# EAGLE schematic VoltageSourcePCB (EAGLE 9.4.2)
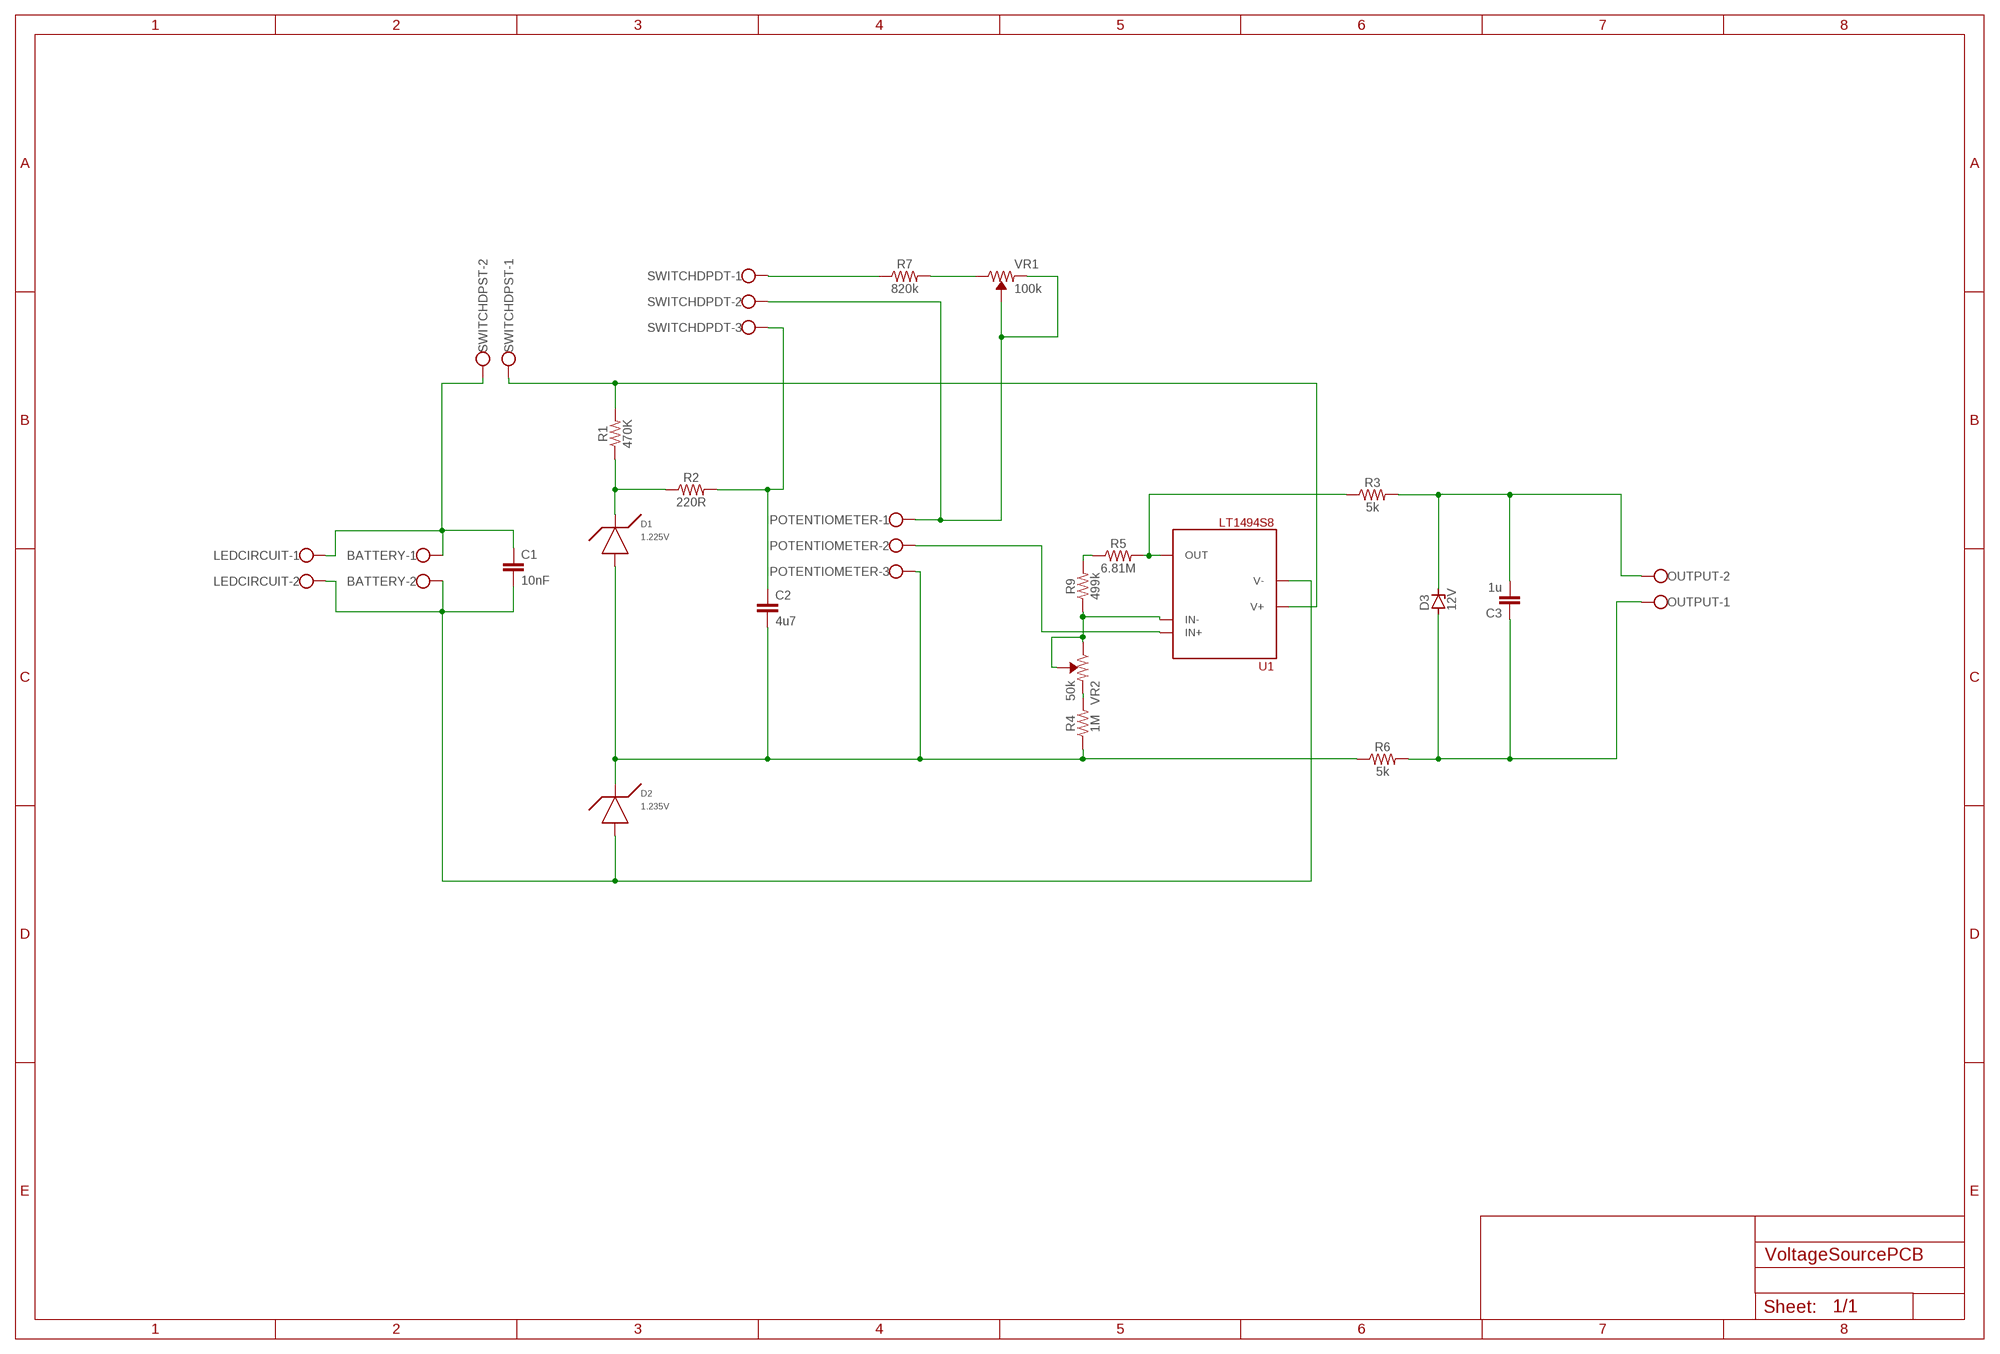
[diagram p0: schematic, sheet 1]

## Parts
BATTERY  W237-102  [W237-102]
C1  10nF  C5/2.5  [C5B2.5]
C2  4u7  C22/11  [C22.5B11]
C3  1u  C-EU150-072X183  [C150-072X183]
D1  1.225V  LT1004CZ1.225V  [LT1004CZ]
D2  1.235V  LT1004CZ1.235V  [LT1004CZ]
D3  12V  ZENER-DIODEC1702-15  [C1702-15]
LEDCIRCUIT  W237-102  [W237-102]
OUTPUT  W237-102  [W237-102]
POTENTIOMETER  W237-103  [W237-103]
R1  470K  RESISTOR0805  [0805]
R2  220R  RESISTOR0805  [0805]
R3  5k  RESISTOR0805  [0805]
R4  1M  RESISTOR0805  [0805]
R5  6.81M  RESISTOR0805  [0805]
R6  5k  RESISTOR0805  [0805]
R7  820k  RESISTOR0805  [0805]
R9  499k  RESISTOR0805  [0805]
SWITCHDPDT  W237-103  [W237-103]
SWITCHDPST  W237-102  [W237-102]
U1  LT1494S8  [LT1494]
VR1  100k  TRIMPOT-SMD-3MM-OPEN-1/10W-25%  [TRIMPOT-SMD-TC33X]
VR2  50k  TRIMPOT-SMD-3MM-OPEN-1/10W-25%  [TRIMPOT-SMD-TC33X]

## Nets
N$1: BATTERY.1 C1.1
N$2: BATTERY.2 C1.2
N$3: D2.ANODE LEDCIRCUIT.2 U1.4(V-)
N$4: LEDCIRCUIT.1 SWITCHDPST.2
N$5: R1.2 SWITCHDPST.1 U1.7(V+)
N$6: D1.CATHODE R1.1 R2.1
N$7: C2.2 D1.ANODE D2.CATHODE POTENTIOMETER.3 R4.1 R6.1
N$8: C2.1 R2.2 SWITCHDPDT.3
N$9: POTENTIOMETER.2 U1.3(IN+)
N$10: R3.1 R5.2 U1.6(OUT)
N$11: POTENTIOMETER.1 SWITCHDPDT.2 VR1.2(WIPER) VR1.3(CCW)
N$12: R7.1 SWITCHDPDT.1
N$13: R9.1 U1.2(IN-) VR2.1(CW) VR2.2(WIPER)
N$16: C3.2 D3.C OUTPUT.2 R3.2
N$17: C3.1 D3.A OUTPUT.1 R6.2
N$18: R4.2 VR2.3(CCW)
N$19: R7.2 VR1.1(CW)
N$20: R5.1 R9.2

## Library data of the parts
BATTERY LEDCIRCUIT OUTPUT SWITCHDPST = con-wago-500:W237-102: WAGO SCREW CLAMP; MPN: 237-102; OC_FARNELL: unknown; OC_NEWARK: 70K9898
C1 C2 = capacitor-wima:C: CAPACITOR naming: grid - package width
C3 = rcl:C-EU: CAPACITOR, European symbol; SPICEPREFIX: C
D1 D2 = RequiredComponents:LT1004CZ: Description: This is a LT1004CZ zener diode that is contained in a 3 pin holder. This can be used as a micropower voltage reference
D3 = diode:ZENER-DIODE: Z-Diode
POTENTIOMETER SWITCHDPDT = con-wago-500:W237-103: WAGO SCREW CLAMP; MPN: 237-103; OC_FARNELL: unknown; OC_NEWARK: 18M7116
R1-R7 R9 = SparkFun-Resistors:RESISTOR: Generic Resistor Package
U1 = RequiredComponents:LT1494: The LT1494 is a very low current op-amp that also has a good noise output, powered by a 36V supply (18V each pin)
VR1 VR2 = SparkFun-Resistors:TRIMPOT: Trimming Potentiometer (Trimpot) Three-terminal potentiometers, with an adjustable wiper and two adjustable resistors. A pot can be used to create a configurable voltage divider, or as a variable resistor. "Trimpots" are a subset of potentiometers, usually intended for "set-and-forget" applications. They're often more delicate than standard potentiometers - rated for fewer turns. Variants PTH-KNOB - PTH Trimpot w/ finger-adjustable knob Trimpot 10K with Knob <https://www.sparkfun.com/products/9806> (COM-09806) Datasheet <http://www.sparkfun.com/datasheets/Components/General/TSR-3386.pdf> SMD-3MM-CLOSED-FRAME - SMD 3mm Square Closed-Frame Trimpot Used on e.g. EasyDriver - Stepper Motor Driver <https://www.sparkfun.com/products/12779> Datasheet <http://www.bitechnologies.com/pdfs/22.pdf> (22AR10KTR) SMD-5MM - SMD 5mm Square Closed-Frame Trimpot Used on e.g. IOIO-OTG - V2.2 <https://www.sparkfun.com/products/13613> Datasheet <http://www.vishay.com/docs/51008/ts53.pdf> (TS53YL502MR10) SMD-3MM-1/10W-25% - 3mm Square Open-Frame Trimpot Used on e.g. SparkFun Shapeoko <https://www.sparkfun.com/products/13899> Datasheet <http://www.bourns.com/docs/Product-Datasheets/TC33.pdf> (TC33X-2-103E); PROD_ID: RES-12428, RES-08048; VALUE: 10k